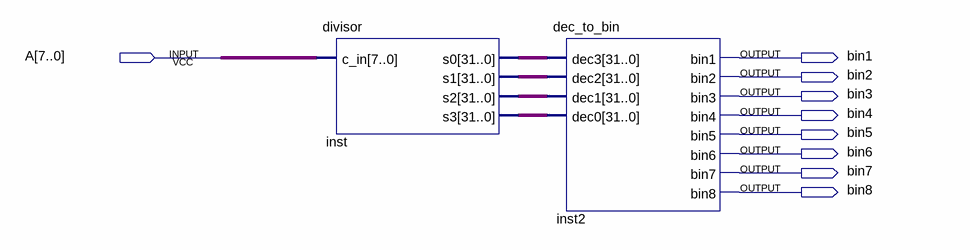
[diagram p0: schematic sheet]
// Quartus schematic blocoDivisor.bdf as structural Verilog: 2 symbols, 9 pins
module blocoDivisor (
  input  [7:0] A,
  output bin1,
  output bin2,
  output bin3,
  output bin4,
  output bin5,
  output bin6,
  output bin7,
  output bin8
);

  wire [31:0] inst_s0, inst_s1, inst_s2, inst_s3;

  divisor inst (.c_in(A), .s0(inst_s0), .s1(inst_s1), .s2(inst_s2), .s3(inst_s3));
  dec_to_bin inst2 (
    .dec3(inst_s0), .dec2(inst_s1), .dec1(inst_s2), .dec0(inst_s3), .bin1(bin1), .bin2(bin2), .bin3(bin3),
    .bin4(bin4), .bin5(bin5), .bin6(bin6), .bin7(bin7), .bin8(bin8));
endmodule
